# EAGLE design communicator_v2p3 (EAGLE 7.6.0)
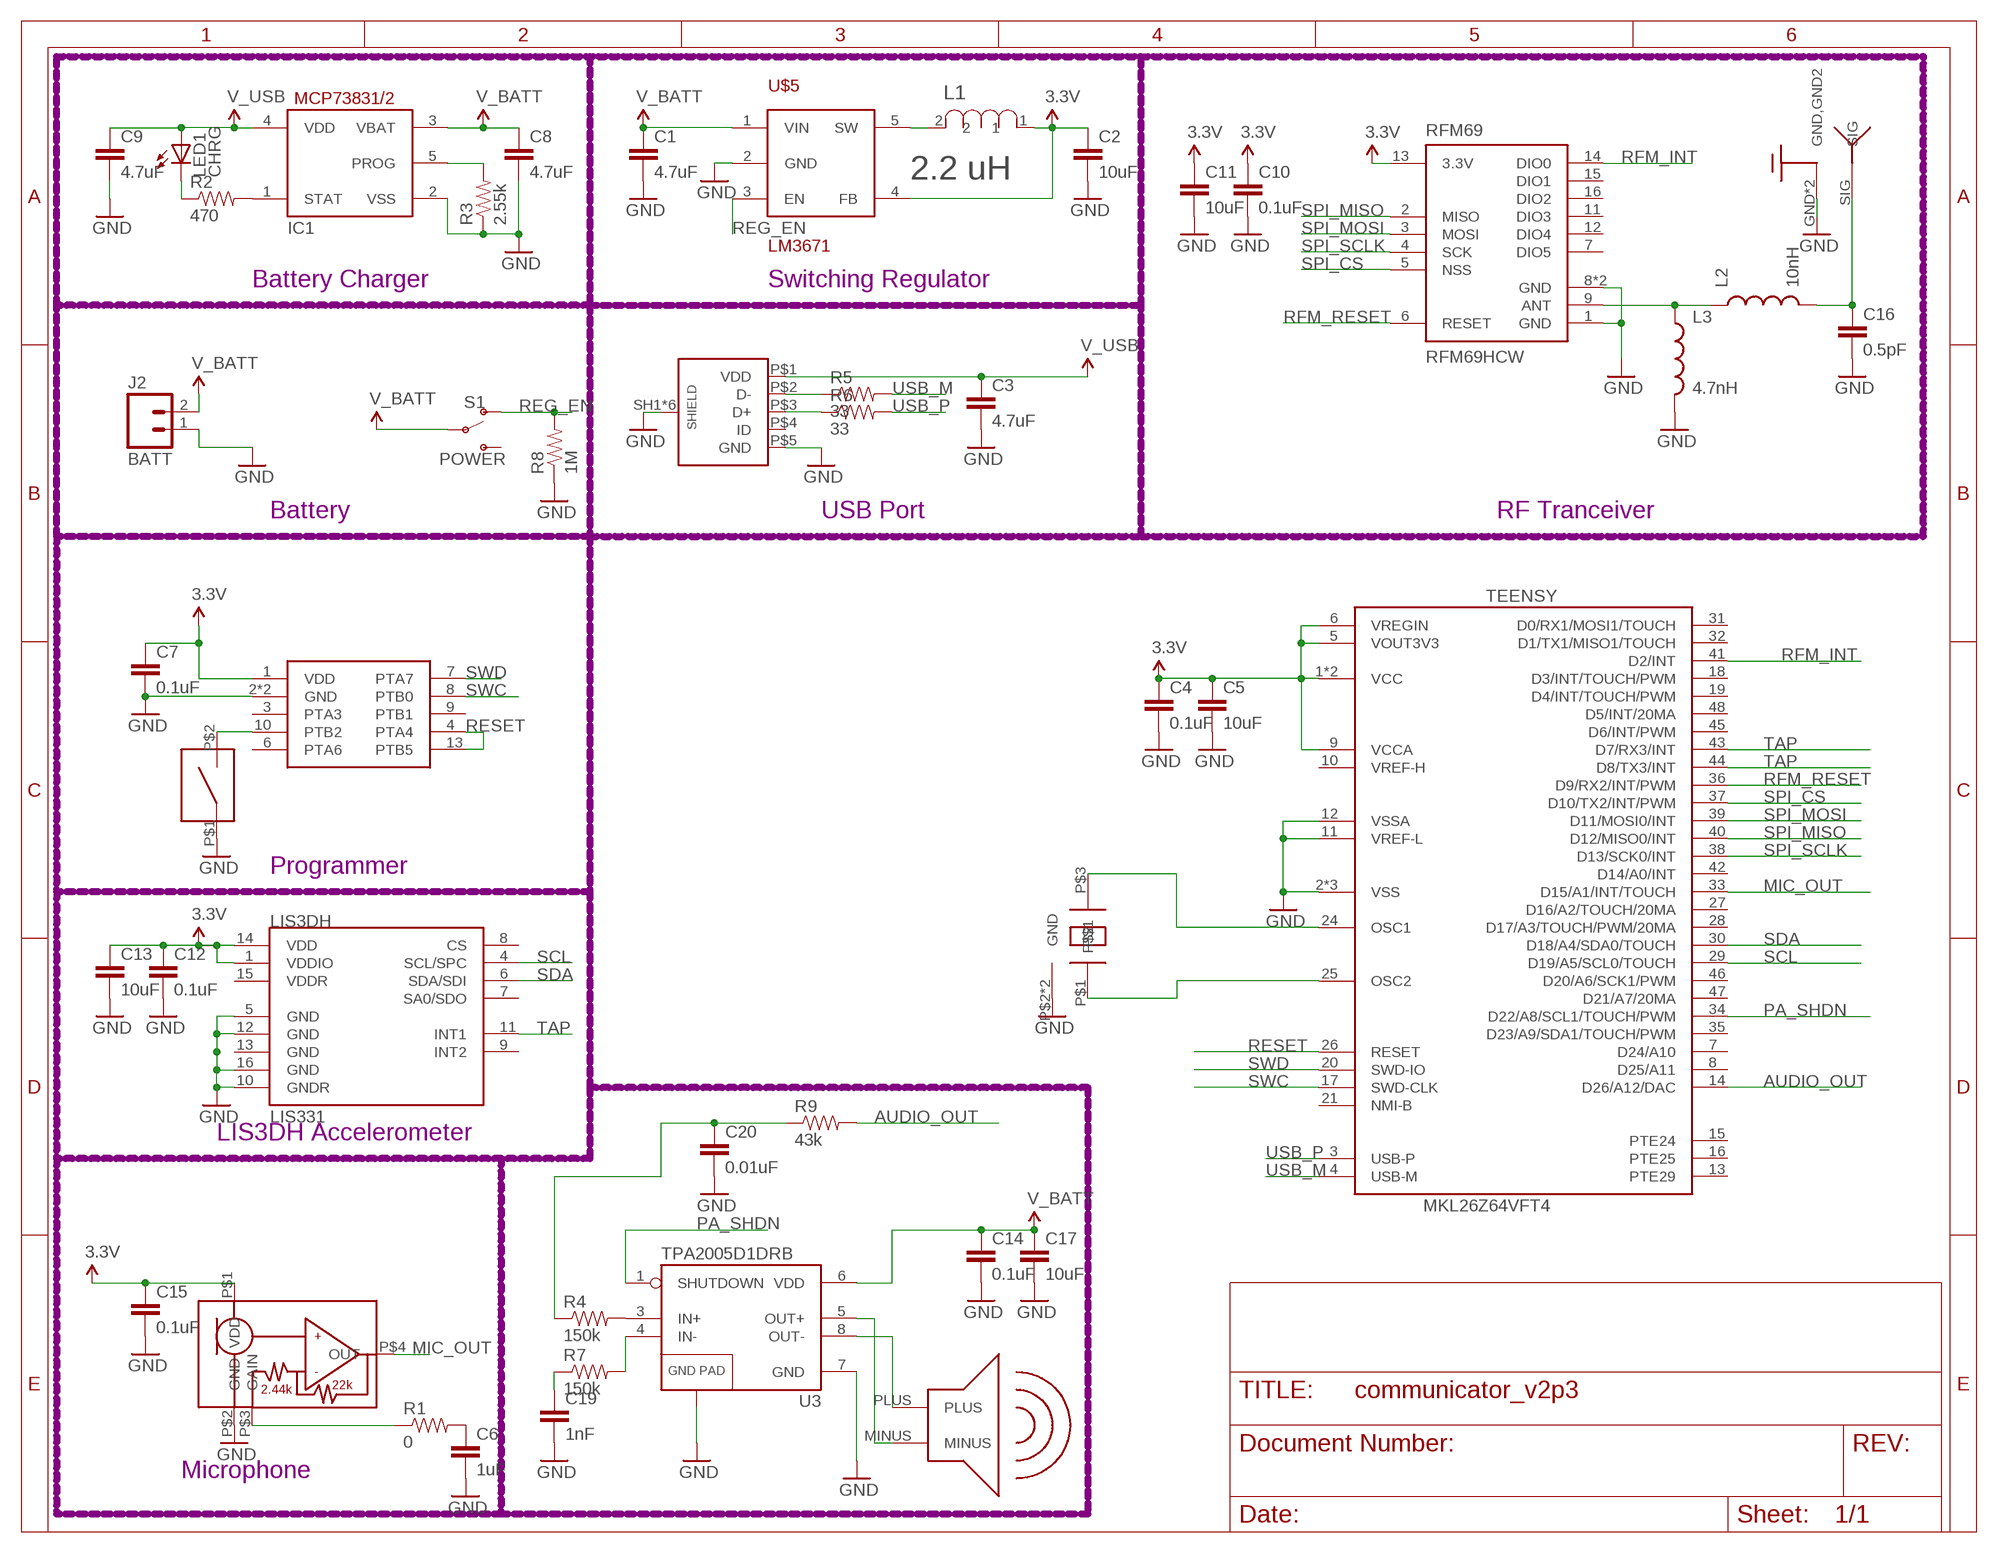
[diagram p0: schematic, sheet 1]

## Parts
3X3MM1  CURRENT_BOOTLOADER3X3MM  [QFN50P300X300X100-17N]
C1  4.7uF  0.1UF-25V(+80/-20%)(0603)  [0603-CAP]
C2  10uF  2.2UF-10V-20%(0603)  [0603-CAP]
C3  4.7uF  2.2UF-10V-20%(0603)  [0603-CAP]
C4  0.1uF  0.1UF-25V(+80/-20%)(0603)  [0603-CAP]
C5  10uF  10UF-6.3V-20%(0603)  [0603-CAP]
C6  1uF  0.1UF-25V(+80/-20%)(0603)  [0603-CAP]
C7  0.1uF  0.1UF-25V(+80/-20%)(0603)  [0603-CAP]
C8  4.7uF  4.7UF-6.3V-10%(0603)0603  [0603-CAP]
C9  4.7uF  4.7UF-6.3V-10%(0603)0603  [0603-CAP]
C10  0.1uF  0.1UF-25V(+80/-20%)(0603)  [0603-CAP]
C11  10uF  10UF-6.3V-20%(0603)  [0603-CAP]
C12  0.1uF  0.1UF-25V(+80/-20%)(0603)  [0603-CAP]
C13  10uF  10UF-6.3V-20%(0603)  [0603-CAP]
C14  0.1uF  0.1UF-25V(+80/-20%)(0603)  [0603-CAP]
C15  0.1uF  0.1UF-25V(+80/-20%)(0603)  [0603-CAP]
C16  0.5pF  0.75PF-50V(-/+.25PF)(0603)  [0603-CAP]
C17  10uF  10UF-6.3V-20%(0603)  [0603-CAP]
C19  1nF  0.1UF-25V(+80/-20%)(0603)  [0603-CAP]
C20  0.01uF  0.1UF-25V(+80/-20%)(0603)  [0603-CAP]
IC1  MCP73831/OT  [SOT23-5L]
J2  BATT  M02PTH  [1X02]
L1  2.2 uH  PM1210-2R2J-RC  [INDC3225X22N]
L2  10nH  INDUCTOR0603  [0603]
L3  4.7nH  INDUCTOR0603  [0603]
LED1  CHRG  LEDCHIPLED_0805  [CHIPLED_0805]
LIS3DH  LIS331  [LGA16-3MM]
R1  0  33OHM1/10W1%(0603)  [0603-RES]
R2  470  470OHM1/10W1%(0603)  [0603-RES]
R3  2.55k  2.55KOHM-1/10W-1%(0603)  [0603-RES]
R4  150k  33OHM1/10W1%(0603)  [0603-RES]
R5  33  33OHM1/10W1%(0603)  [0603-RES]
R6  33  33OHM1/10W1%(0603)  [0603-RES]
R7  150k  33OHM1/10W1%(0603)  [0603-RES]
R8  1M  2.55KOHM-1/10W-1%(0603)  [0603-RES]
R9  43k  33OHM1/10W1%(0603)  [0603-RES]
RFM69  RFM69HCW  [RFM69HCW-XXXS2]
S1  POWER  SWITCH-SPDT-SMD-RIGHT-ANGLE  [SWITCH_SPST_SMD_A]
TEENSY  MKL26Z64VFT4  [QFN50P700X700X100-49N]
U3  TPA2005D1DRB  [QFN-8_PAD]
U$1  ANTENNA_915MHZ  [ANTENNA_915MHZ]
U$2  MICROPHONE  [SPU0414HR5H-SB]
U$3  SPEAKER  [PSR1511N08S3K]
U$4  KXT131LHS  [KXT131LHS]
U$5  LM3671  [SOT23-5]
U$8  MICRO_USB_B  [MICRO_USB_B]
U$9  TSX-3225  [TSX-3225]

## Nets
3.3V: 3X3MM1.1(VDD) C2.1 C4.1 C5.1 C7.1 C10.1 C11.1 C12.1 C13.1 C15.1 L1.1 LIS3DH.1(VDDIO) LIS3DH.14(VDD) RFM69.13(3.3V) TEENSY.1(VCC) TEENSY.5(VOUT3V3) TEENSY.6(VREGIN) TEENSY.9(VCCA) TEENSY.22(VCC) U$2.P$1(VDD) U$5.4(FB)
AUDIO_OUT: R9.2 TEENSY.14(D26/A12/DAC)
GND: 3X3MM1.2(GND) 3X3MM1.17(GND) C1.2 C2.2 C3.2 C4.2 C5.2 C6.2 C7.2 C8.2 C9.2 C10.2 C11.2 C12.2 C13.2 C14.2 C15.2 C16.2 C17.2 C19.2 C20.2 IC1.2(VSS) J2.1 L3.2 LIS3DH.5(GND) LIS3DH.10(GNDR) LIS3DH.12(GND) LIS3DH.16(GND) R3.1 R8.1 RFM69.1(GND) RFM69.8(GND) RFM69.10(GND) TEENSY.2(VSS) TEENSY.11(VREF-L) TEENSY.12(VSSA) TEENSY.23(VSS) TEENSY.49(VSS) U3.7(GND) U3.9(GND) U3.10(GND) U3.11(GND) U3.12(GND) U3.13(GND) U$1.GND2(GND,GND2) U$1.GND(GND,GND2) U$2.P$2(GND) U$4.P$1 U$5.2(GND) U$8.P$5(GND) U$8.SH1(SHIELD) U$8.SH2(SHIELD) U$8.SH3(SHIELD) U$8.SH4(SHIELD) U$8.SH5(SHIELD) U$8.SH6(SHIELD) U$9.P$2(GND) U$9.P$4(GND)
MIC_OUT: TEENSY.33(D15/A1/INT/TOUCH) U$2.P$4(OUT)
N$1: R1.1 U$2.P$3(GAIN)
N$2: IC1.1(STAT) R2.2
N$3: C6.1 R1.2
N$4: C16.1 L2.2 U$1.SIG
N$5: TEENSY.24(OSC1) U$9.P$3
N$6: TEENSY.25(OSC2) U$9.P$1
N$7: U3.5(OUT+) U$3.MINUS
N$8: L2.1 L3.1 RFM69.9(ANT)
N$9: 3X3MM1.10(PTB2) U$4.P$2
N$10: U3.8(OUT-) U$3.PLUS
N$11: R4.2 U3.3(IN+)
N$12: R7.2 U3.4(IN-)
N$14: R5.1 U$8.P$2(D-)
N$15: R6.1 U$8.P$3(D+)
N$16: C19.1 R7.1
N$21: IC1.5(PROG) R3.2
N$25: LED1.C R2.1
N$31: L1.2 U$5.5(SW)
PA_IN: C20.1 R4.1 R9.1
PA_SHDN: TEENSY.34(D22/A8/SCL1/TOUCH/PWM) U3.1(SHUTDOWN)
REG_EN: R8.2 S1.1(O) U$5.3(EN)
RESET: 3X3MM1.4(PTA4) 3X3MM1.13(PTB5) TEENSY.26(RESET)
RFM_INT: RFM69.14(DIO0) TEENSY.41(D2/INT)
RFM_RESET: RFM69.6(RESET) TEENSY.36(D9/RX2/INT/PWM)
SCL: LIS3DH.4(SCL/SPC) TEENSY.29(D19/A5/SCL0/TOUCH)
SDA: LIS3DH.6(SDA/SDI) TEENSY.30(D18/A4/SDA0/TOUCH)
SPI_CS: RFM69.5(NSS) TEENSY.37(D10/TX2/INT/PWM)
SPI_MISO: RFM69.2(MISO) TEENSY.40(D12/MISO0/INT)
SPI_MOSI: RFM69.3(MOSI) TEENSY.39(D11/MOSI0/INT)
SPI_SCLK: RFM69.4(SCK) TEENSY.38(D13/SCK0/INT)
SWC: 3X3MM1.8(PTB0) TEENSY.17(SWD-CLK)
SWD: 3X3MM1.7(PTA7) TEENSY.20(SWD-IO)
TAP: LIS3DH.11(INT1) TEENSY.43(D7/RX3/INT) TEENSY.44(D8/TX3/INT)
USB_M: R5.2 TEENSY.4(USB-M)
USB_P: R6.2 TEENSY.3(USB-P)
V_BATT: C1.1 C8.1 C14.1 C17.1 IC1.3(VBAT) J2.2 S1.2(P) U3.6(VDD) U$5.1(VIN)
V_USB: C3.1 C9.1 IC1.4(VDD) LED1.A U$8.P$1(VDD)
Unconnected: 3X3MM1.3(PTA3) 3X3MM1.6(PTA6) 3X3MM1.9(PTB1) LIS3DH.7(SA0/SDO) LIS3DH.8(CS) LIS3DH.9(INT2) LIS3DH.13(GND) LIS3DH.15(VDDR) RFM69.7(DIO5) RFM69.11(DIO3) RFM69.12(DIO4) RFM69.15(DIO1) RFM69.16(DIO2) S1.3(S) TEENSY.7(D24/A10) TEENSY.8(D25/A11) TEENSY.10(VREF-H) TEENSY.13(PTE29) TEENSY.15(PTE24) TEENSY.16(PTE25) TEENSY.18(D3/INT/TOUCH/PWM) TEENSY.19(D4/INT/TOUCH/PWM) TEENSY.21(NMI-B) TEENSY.27(D16/A2/TOUCH/20MA) TEENSY.28(D17/A3/TOUCH/PWM/20MA) TEENSY.31(D0/RX1/MOSI1/TOUCH) TEENSY.32(D1/TX1/MISO1/TOUCH) TEENSY.35(D23/A9/SDA1/TOUCH/PWM) TEENSY.42(D14/A0/INT) TEENSY.45(D6/INT/PWM) TEENSY.46(D20/A6/SCK1/PWM) TEENSY.47(D21/A7/20MA) TEENSY.48(D5/INT/20MA) U$8.P$4(ID)

## Notes on the sheet
- Battery Charger | Switching Regulator
- Battery | USB Port | RF Tranceiver
- Programmer
- LIS3DH Accelerometer
- Microphone

## Library data of the parts
3X3MM1 = Teensy_DIY_v1.0:CURRENT_BOOTLOADER: MKL02Z32 and MKL04Z32 bootloader chips for Teensy LC (MKL26) and Teensy 3.2 (MKL20D256) processors. Remember, all power supply pins need to be decoupled! Also note the connections that Paul recommends on his bootloader page.
C1 C6 C19 C20 = SparkFun-Capacitors:0.1UF-25V(+80/-20%)(0603): CAP-00810 Ceramic Standard decoupling cap; PROD_ID: CAP-00810; VALUE: 0.1uF
C2 C3 = SparkFun-Capacitors:2.2UF-10V-20%(0603): CAP-07888; PROD_ID: CAP-07888; VALUE: 2.2uF
C4 C7 C10 C12 C14 C15 = SparkFun-Capacitors:0.1UF-25V(+80/-20%)(0603): CAP-00810 Ceramic Standard decoupling cap; PROD_ID: CAP-00810
C5 C11 C13 C17 = SparkFun-Capacitors:10UF-6.3V-20%(0603): CAP-11015; PROD_ID: CAP-11015
C8 C9 = SparkFun-Capacitors:4.7UF-6.3V-10%(0603): CAP-08280; PROD_ID: CAP-08280
C16 = SparkFun-Capacitors:0.75PF-50V(-/+.25PF)(0603): CAP-07878; PROD_ID: CAP-07878; VALUE: 0.75pF
IC1 = adafruit:MCP73831: MCP73831/2 Miniature Single-Cell, Fully Integrated Li-Ion, Li-Polymer Charge Management Controllers. Nice and small simple lipoly charge controller, with adjustable current and status output (LED) http://www.ladyada.net/library/pcb/eaglelibrary.html
J2 = SparkFun-Connectors:M02: Standard 2-pin 0.1" header. Use with - straight break away headers ( PRT-00116) - right angle break away headers (PRT-00553) - swiss pins (PRT-00743) - machine pins (PRT-00117) - female headers (PRT-00115) Molex polarized connector foot print use with: PRT-08233 with associated crimp pins and housings. 2.54_SCREWTERM for use with PRT-10571. 3.5mm Screw Terminal footprints for PRT-08084 5mm Screw Terminal footprints for use with PRT-08432
L1 = Bourns_By_element14_Batch_1:PM1210-2R2J-RC: CHIP INDUCTOR, 2.2UH 320MA 5% 75MHZ; MPN: PM1210-2R2J-RC; OC_FARNELL: 1180471; OC_NEWARK: 63K3102; SUPPLIER: BOURNS; TOLERANCE: ±5 %
L2 L3 = SparkFun-Passives:INDUCTOR: Inductors Basic Inductor/Choke - 0603 and 1206. Footprints are not proven and vary greatly between part numbers. INDUCTOR POWER 3.3UH 4.0A SMD 0.197" L x 0.197" W x 0.177" H (5.00mm x 5.00mm x 4.50mm)
LED1 = adafruit:LED: LED OSRAM: - CHIPLED LG R971, LG N971, LY N971, LG Q971, LY Q971, LO R971, LY R971 LH N974, LH R974 LS Q976, LO Q976, LY Q976 LO Q996 - Hyper CHIPLED LW Q18S LB Q993, LB Q99A, LB R99A - SideLED LS A670, LO A670, LY A670, LG A670, LP A670 LB A673, LV A673, LT A673, LW A673 LH A674 LY A675 LS A676, LA A676, LO A676, LY A676, LW A676 LS A679, LY A679, LG A679 - Hyper Micro SIDELED® LS Y876, LA Y876, LO Y876, LY Y876 LT Y87S - SmartLED LW L88C, LW L88S LB L89C, LB L89S, LG L890 LS L89K, LO L89K, LY L89K LS L896, LA L896, LO L896, LY L896 - TOPLED LS T670, LO T670, LY T670, LG T670, LP T670 LSG T670, LSP T670, LSY T670, LOP T670, LYG T670 LG T671, LOG T671, LSG T671 LB T673, LV T673, LT T673, LW T673 LH T674 LS T676, LA T676, LO T676, LY T676, LB T676, LH T676, LSB T676, LW T676 LB T67C, LV T67C, LT T67C, LS T67K, LO T67K, LY T67K, LW E67C LS E67B, LA E67B, LO E67B, LY E67B, LB E67C, LV E67C, LT E67C LW T67C LS T679, LY T679, LG T679 LS T770, LO T770, LY T770, LG T770, LP T770 LB T773, LV T773, LT T773, LW T773 LH T774 LS E675, LA E675, LY E675, LS T675 LS T776, LA T776, LO T776, LY T776, LB T776 LHGB T686 LT T68C, LB T68C - Hyper Mini TOPLED® LB M676 - Mini TOPLED Santana® LG M470 LS M47K, LO M47K, LY M47K Source: http://www.osram.convergy.de/
LIS3DH = SparkFun-Sensors:LIS331: 3-axis 6/12/24g SPI/I2C accelerometer
R1 R4 R7 R9 = SparkFun-Resistors:33OHM1/10W1%(0603): RES-08270; PROD_ID: RES-08270; VALUE: 33
R2 = SparkFun-Resistors:470OHM1/10W1%(0603): RES-07869; PROD_ID: RES-07869
R3 = SparkFun-Resistors:2.55KOHM-1/10W-1%(0603): RES-11227; PROD_ID: RES-11227
R5 R6 = SparkFun-Resistors:33OHM1/10W1%(0603): RES-08270; PROD_ID: RES-08270
R8 = SparkFun-Resistors:2.55KOHM-1/10W-1%(0603): RES-11227; PROD_ID: RES-11227; VALUE: 2.55k
RFM69 = SparkFun-RF:RFM69H; PROD_ID: IC-11997, IC-12053
S1 = SparkFun-Switches:SWITCH-SPDT: Single Pole, Double Throw (SPDT) Switch Single-pole, double-throw (SPDT) switch. Variant Overview SMD-AYZ0202 Surface Mount DPDT Switch <https://www.sparkfun.com/products/597> (COM-00597) Used on e.g. LilyPad Arduino USB - ATmega32U4 Board <https://www.sparkfun.com/products/12049> PTH-11.6X4.0MM SPDT Mini Power Switch <https://www.sparkfun.com/products/102> (COM-00102) Used on e.g. SparkFun Simon Says - Through-Hole Soldering Kit <https://www.sparkfun.com/products/10547> (KIT-10547) PTH-11.6X4.0MM-KIT KIT version of SPDT Mini Power Switch - Simplifies soldering by removing tStop of switch pins - only one side can be soldered. PTH-11.6X4.0MM-LOCK LOCK version of SPDT Mini Power Switch - Offset pins hold switch in place for easier soldering. SMD-RIGHT-ANGLE Surface Mount Right Angle Switch <https://www.sparkfun.com/products/10860> (COM-10860) Used on e.g. SparkFun ESP8266 Thing <https://www.sparkfun.com/products/13231>; PROD_ID: SWCH-10651; SF_SKU: COM-10860
TEENSY = Teensy_DIY_v1.0:MKL26Z64VFT4: This is a Teensy LC MCU based on the MKL26Z64VFT4. Note: To enable USB, you need to have 3.3V at VOUT3V3. If you want to supply 3.3V power externally, provide it to VCC, VREGIN, and VOUT3V3. The Voltage Regulator will go into dropout mode.
U3 = SparkFun-AnalogIC:TPA2005D1: 1.4W MONO CLASS-D AUDIO POWER AMPLIFIER The TPA2005D1 is a 1.4-W high efficiency filter-free class-D audio power amplifier in a BGA, QFN, or MSOP package that requires only three external components. Datasheet: http://focus.ti.com/lit/ds/symlink/tpa2005d1.pdf 1.4 W Into 8 ? From a 5V Supply at THD = 10% (Typ) Maximum Battery Life and Minimum Heat Efficiency With an 8-? Speaker: 84% at 400 mW, 79% at 100 mW 2.8-mA Quiescent Current 0.5-mA Shutdown Current Ideal for Wireless or Cellular Handsets and PDAs Capable of Driving an 8-? Speaker (2.5 V ? VDD ? 5.5 V) and a 4-? Speaker (2.5 V ? VDD ? 4.2 V) Only Three External Components Optimized PWM Output Stage Eliminates LC Output Filter Internally Generated 250-kHz Switching Frequency Eliminates Capacitor and Resistor Improved PSRR (-71 dB at 217 Hz) and Wide Supply Voltage (2.5 V to 5.5 V) Eliminates Need for a Voltage Regulator Fully Differential Design Reduces RF Rectification and Eliminates Bypass Capacitor Improved CMRR Eliminates Two Input Coupling Capacitors
U$1 = prototype:ANTENNA_915MHZ
U$2 = prototype:MICROPHONE
U$3 = prototype:SPEAKER
U$4 = prototype:KXT131LHS
U$5 = texas-custom:LM3671: Texas Instruments LM3671, LM3671Q 2MHz, 600mA Step-Down DC-DC Converter
U$8 = prototype:MICRO_USB_B
U$9 = prototype:TSX-3225

## Board
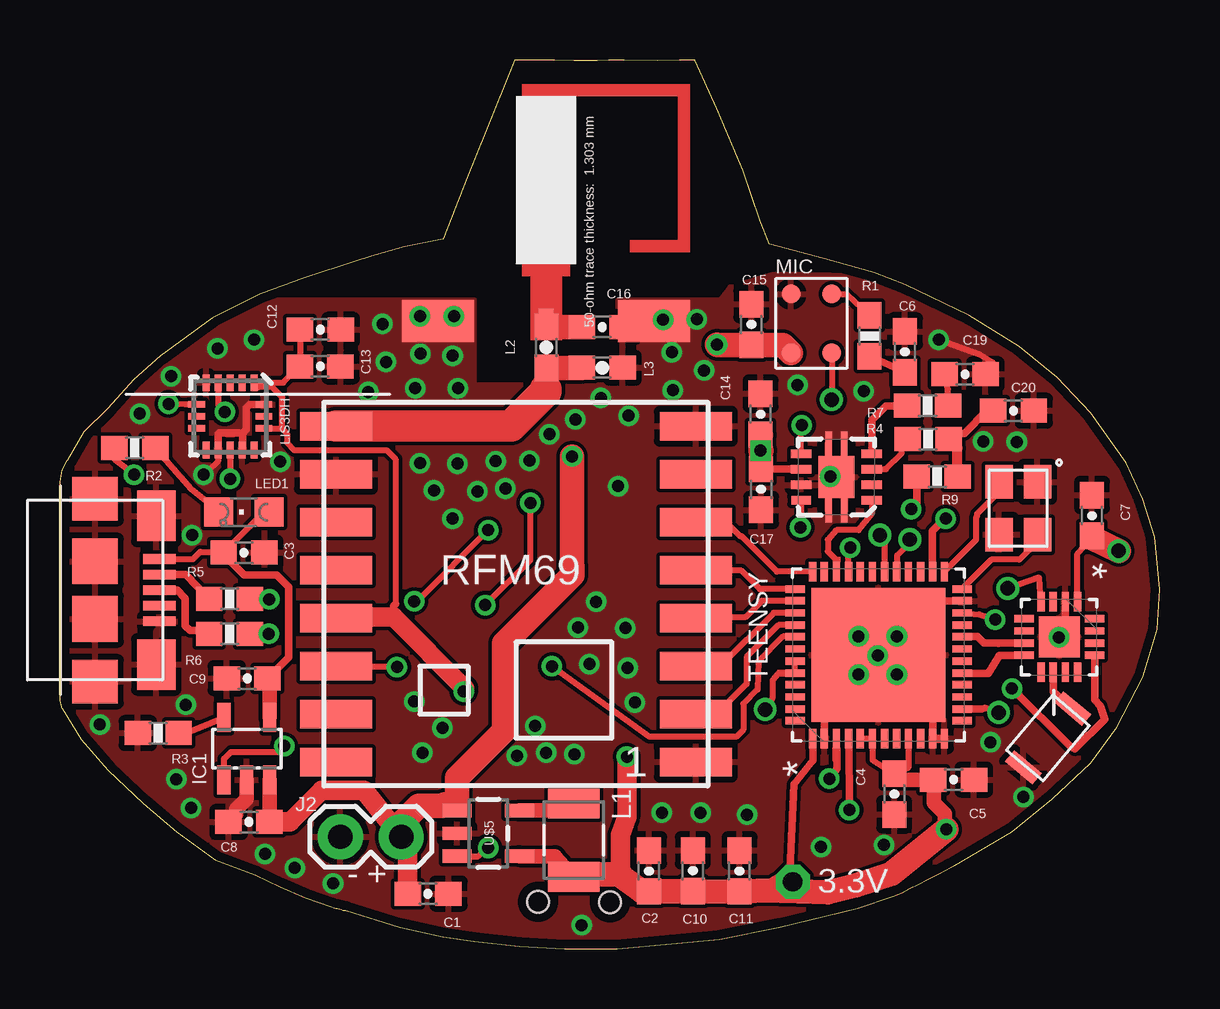
[diagram p1: board, top side]
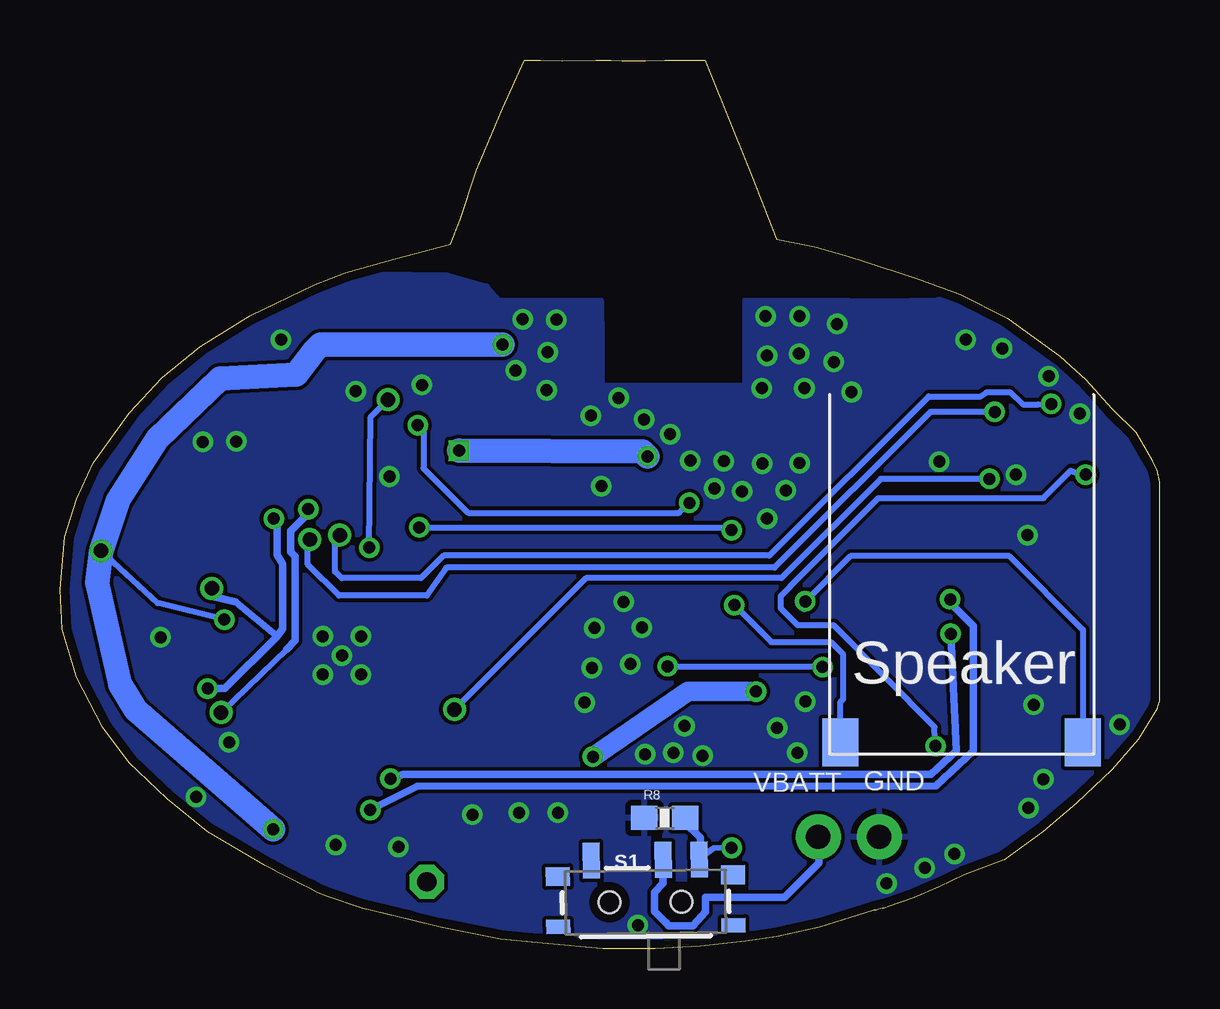
[diagram p2: board, bottom side, seen from below]

Size 45.84 x 37.04 mm. Coordinates in mm from the lower left corner, seen from the top.
Outline: 0.1,10.02 0.89,8.73 1.98,7.44 3.47,6.05 4.86,4.86 6.47,3.71 8.14,3.08 arc10 11.33,1.74 11.33,1.74 11.43,1.71 11.49,1.69 11.56,1.67 11.71,1.63 11.81,1.61 11.91,1.59 14.19,0.89 15.97,0.5 17.26,0.3 19.15,0.1 21.03,0 23.22,0 25.5,0.2 27.48,0.4 29.96,0.89 31.25,1.19 33.24,1.69 34.72,2.18 35.09,2.32 35.42,2.51 35.78,2.69 36.17,2.89 36.67,3.15 37.13,3.38 37.3,3.47 39.69,4.86 41.37,6.25 42.96,7.74 44.05,9.23 45.14,11.31 45.74,13.29 45.84,14.98 45.64,17.16 45.14,18.75 44.45,20.24 42.96,22.32 41.57,23.81 39.98,25.1 37.9,26.39 35.22,27.68 33.93,28.18 31.85,28.77 29.57,29.37 29.17,30.36 28.47,32.44 27.38,35.02 26.47,37.02 25.82,37.03 24.9,37.02 23.51,37.03 22.87,37.02 22.42,37.02 22.02,37.02 21.42,37.02 20.61,37.03 19.78,37.04 18.95,37.03 16.97,32.15 15.97,29.57 14.39,29.27 13,28.87 10.22,27.98 8.33,27.28 6.35,26.29 4.17,24.7 3.08,23.71 1.98,22.52 0.99,21.53 0.3,20.34 0.1,19.94 0,19.45 0,10.32 0.1,10.02
Copper layers (1*16): Top 0.0356mm / dielectric 1.5011mm / Bottom 0.0356mm
Design rules "oshpark-2layer *": minimum track width 6mil, minimum drill 13mil, track to track 6mil, track to pad 6mil, pad to pad 6mil, via to via 6mil, smd to smd 6mil, copper to edge 15mil, drill to drill 6mil, minimum pad ring 7mil, minimum via ring 7mil, stop-mask expansion 2.5mil, vias tented up to drill 0.51mm, thermal gap 10mil

### Footprints (pad centres in the part's own frame; a part is rotated, then mirrored left to right if it is on the bottom)
QFN50P300X300X100-17N = smd 0.813 x 0.305: 1 -1.473,0.762; 2 -1.473,0.254; 3 -1.473,-0.254; 4 -1.473,-0.762; 9 1.473,-0.762; 10 1.473,-0.254; 11 1.473,0.254; 12 1.473,0.762 | smd 0.305 x 0.813: 5 -0.762,-1.473; 6 -0.254,-1.473; 7 0.254,-1.473; 8 0.762,-1.473; 13 0.762,1.473; 14 0.254,1.473; 15 -0.254,1.473; 16 -0.762,1.473 | smd 1.702 x 1.702: 17 0,0
0603-CAP = smd 1.1 x 1: 1 -0.85,0; 2 0.85,0
SOT23-5L = smd 0.55 x 1.2: 1 -0.95,-1.3; 2 0,-1.3; 3 0.95,-1.3; 4 0.95,1.3; 5 -0.95,1.3
1X02 = drill 1.016 pad 1.88: 1 0,0; 2 2.54,0
INDC3225X22N = smd 1.245 x 2.159: 1 -1.524,0; 2 1.524,0
0603 = smd 1.1 x 1: 1 -0.85,0; 2 0.85,0
CHIPLED_0805 = smd 1.2 x 1.2: A 0,-1.05; C 0,1.05
LGA16-3MM = smd 0.7 x 0.28: 1 -1.4,1; 2 -1.4,0.5; 3 -1.4,0; 4 -1.4,-0.5; 5 -1.4,-1; 9 1.4,-1; 10 1.4,-0.5; 11 1.4,0; 12 1.4,0.5; 13 1.4,1 | smd 0.28 x 0.7: 6 -0.5,-1.4; 7 0,-1.4; 8 0.5,-1.4; 14 0.5,1.4; 15 0,1.4; 16 -0.5,1.4
0603-RES = smd 1.1 x 1: 1 -0.85,0; 2 0.85,0
RFM69HCW-XXXS2 = smd 3 x 1.2: 1 -7.5,7; 2 -7.5,5; 3 -7.5,3; 4 -7.5,1; 5 -7.5,-1; 6 -7.5,-3; 7 -7.5,-5; 8 -7.5,-7; 9 7.5,-7; 10 7.5,-5; 11 7.5,-3; 12 7.5,-1; 13 7.5,1; 14 7.5,3; 15 7.5,5; 16 7.5,7
SWITCH_SPST_SMD_A = smd 0.7 x 1.5: 1 -2.25,-1.75; 2 -0.75,-1.75; 3 2.25,-1.75 | smd 1 x 0.6: GND1 -3.65,1; GND3 3.65,1 | smd 1 x 0.8: GND2 -3.65,-1.1; GND4 3.65,-1.1 | hole 0.9: -1.5,0; 1.5,0
QFN50P700X700X100-49N = smd 0.813 x 0.305: 1 -3.48,2.743; 2 -3.48,2.261; 3 -3.48,1.753; 4 -3.48,1.245; 5 -3.48,0.762; 6 -3.48,0.254; 7 -3.48,-0.254; 8 -3.48,-0.762; 9 -3.48,-1.245; 10 -3.48,-1.753; 11 -3.48,-2.261; 12 -3.48,-2.743; 25 3.48,-2.743; 26 3.48,-2.261; 27 3.48,-1.753; 28 3.48,-1.245; 29 3.48,-0.762; 30 3.48,-0.254; 31 3.48,0.254; 32 3.48,0.762; 33 3.48,1.245; 34 3.48,1.753; 35 3.48,2.261; 36 3.48,2.743 | smd 0.305 x 0.813: 13 -2.743,-3.48; 14 -2.261,-3.48; 15 -1.753,-3.48; 16 -1.245,-3.48; 17 -0.762,-3.48; 18 -0.254,-3.48; 19 0.254,-3.48; 20 0.762,-3.48; 21 1.245,-3.48; 22 1.753,-3.48; 23 2.261,-3.48; 24 2.743,-3.48; 37 2.743,3.48; 38 2.261,3.48; 39 1.753,3.48; 40 1.245,3.48; 41 0.762,3.48; 42 0.254,3.48; 43 -0.254,3.48; 44 -0.762,3.48; 45 -1.245,3.48; 46 -1.753,3.48; 47 -2.261,3.48; 48 -2.743,3.48 | smd 5.588 x 5.588: 49 0,0
QFN-8_PAD = smd 0.35 x 0.85: 1 -0.975,-1.475; 2 -0.325,-1.475; 3 0.325,-1.475; 4 0.975,-1.475; 5 0.975,1.475; 6 0.325,1.475; 7 -0.325,1.475; 8 -0.975,1.475 | smd 1.75 x 1.5: 9 0,0 | smd 1.025 x 0.28: 10 -1.387,-0.325; 11 1.387,-0.325; 12 1.387,0.325; 13 -1.387,0.325
ANTENNA_915MHZ = smd 1.75 x 3: GND -3.12,4.5; GND2 -3.12,-4.5 | smd 1.27 x 0.635: SIG -3.25,0
SPU0414HR5H-SB = smd 0.8 x 0.8: P$1 0.85,1.23; P$2 0.85,-1.23; P$3 -0.85,-1.23; P$4 -0.85,1.23
PSR1511N08S3K = smd 1.5 x 2: MINUS 5.05,7; PLUS -5.05,7
KXT131LHS = smd 0.6 x 1.5: P$1 -1.6,0; P$2 1.6,0
SOT23-5 = smd 0.55 x 1.2: 1 -0.95,-1.3; 2 0,-1.3; 3 0.95,-1.3; 4 0.95,1.3; 5 -0.95,1.3
MICRO_USB_B = smd 0.4 x 1.35: P$1 -1.3,2.675; P$2 -0.65,2.675; P$3 0,2.675; P$4 0.65,2.675; P$5 1.3,2.675 | smd 2.1 x 1.6: SH1 -3.1,2.55; SH2 3.1,2.55 | smd 1.8 x 1.9: SH3 -3.81,0; SH6 3.81,0 | smd 1.9 x 1.9: SH4 -1.2,0; SH5 1.2,0
TSX-3225 = smd 1.4 x 1.15: P$1 -1.1,-0.8; P$2 1.1,-0.8; P$3 1.1,0.8; P$4 -1.1,0.8

### Placement (x,y rotation side)
3X3MM1  41.65,12.99 270 top
C1  15.34,2.29 0 top
C2  24.55,3.24 90 top
C3  7.67,16.5 0 top
C4  34.77,6.44 270 top
C5  37.25,7.04 0 top
C6  35.23,24.88 90 top
C7  43.02,18.05 90 top
C8  7.88,5.28 180 top
C9  7.8,11.26 180 top
C10  26.38,3.24 90 top
C11  28.33,3.24 90 top
C12  10.85,25.8 0 top
C13  10.85,24.27 0 top
C14  29.21,22.28 90 top
C15  28.82,26.01 90 top
C16  22.6,25.91 0 top
C17  29.23,19.14 270 top
C19  37.73,23.94 0 top
C20  39.75,22.42 0 top
IC1  7.79,8.34 0 top
J2  11.69,4.66 0 top
L1  21.41,4.52 90 top
L2  20.27,25.06 90 top
L3  22.6,24.21 0 top
LED1  7.66,18.2 90 top
LIS3DH  7.1,22.19 270 top
R1  33.75,25.54 270 top
R2  3.12,20.88 180 top
R3  4.1,8.98 0 top
R4  36.19,21.24 180 top
R5  7.07,14.58 0 top
R6  7.07,13.11 0 top
R7  36.17,22.64 180 top
R8  20.63,5.44 0 bottom
R9  36.57,19.68 180 top
RFM69  19,14.78 180 top
S1  21.43,1.94 180.6 bottom
TEENSY  34.12,12.24 90 top
U3  32.37,19.66 90 top
U$1  20.27,29.28 90 top
U$2  31.33,26.06 180 top
U$3  8.25,15.6 180 bottom
U$4  41.19,8.78 50 top
U$5  17.85,4.8 270 top
U$8  1.47,14.94 270 top
U$9  39.95,18.36 270 top

### Tracks (layer width: path | path; a pad name or v marks a point on that pad's centre or on a via)
3.3V  (via drill 0.5, 0.6, 0.8 pad 1.42)
  Top 0.254: 24.36,2.66 C2.1 | TEENSY.5 TEENSY.6 33.87,7.86 C4.1 35.36,7.54 TEENSY.9 | LIS3DH.14 9.24,21.69 9.26,21.67 | 9.26,21.67 9.26,22.98 8.83,23.41 8.28,23.41 LIS3DH.1 9.31,23.59 C13.1 C12.1 | 43.02,17.13 42.41,16.46 3X3MM1.1 | TEENSY.22 38.32,13.93 v38.99,13.72 | 9.26,21.67 9.47,21.47 9.47,21.1 9.77,20.78 13.61,20.78 13.99,20.4 13.99,14.36 | 16.87,10.77 v16.83,10.72 | v23.63,8 23.91,6.74
  Top 0.305: TEENSY.1 31.38,7.85 30.59,6.84 30.41,2.83 | 36.89,4.88 36.89,4.92 v36.95,4.98 | v30.55,2.78 29.81,2.14 30.08,2.41 | 13.91,13.82 13.91,14.28 13.99,14.36
  Top 0.61: U$5.4 20.64,3.86 L1.1 | 36.89,4.88 36.89,5.62 36.43,6.08 36.43,7.02 C5.1 34.87,7.04 C4.1
  Top 0.813: v23.63,8 23.63,5.5 23.37,4.74 23.37,3.1 | 16.87,10.77 16.87,10.85 13.91,13.82 11.55,13.82 RFM69.13
  Top 1.016: 29.73,2.42 C11.1 26.42,2.37 C10.1 25.4,2.39 C2.1 24.27,2.38 23.37,3.04 23.37,3.1 22.42,3.1 L1.1 | C7.1 43.02,17.13 v44.13,16.58 | 29.73,2.42 30.08,2.41 32.01,2.34 33.19,2.64 34.67,3.12 v36.95,4.98 | 29.73,2.42 30.41,2.83 | v27.39,25.18 27.4,25.16 C15.1 30.14,25.16 U$2.P$1
  Bottom 0.254: v38.99,13.72 41.77,14.4 v44.13,16.58
  Bottom 0.813: v16.83,10.72 19.67,10.72 v23.63,8
  Bottom 1.016: v36.95,4.98 42.69,9.94 43.33,11.02 44.29,15.24 v44.13,16.58 43.41,18.7 41.79,21.24 39.17,23.76 35.99,23.92 35.25,24.9 34.97,25.18 v27.39,25.18
AUDIO_OUT  (via drill 0.5, 0.6)
  Top 0.254: v39.13,9.84 38.55,10.04 38.49,9.98 TEENSY.14 | TEENSY.14
  Top 0.305: 35.45,18.52 35.59,18.3 v35.49,18.32 35.72,18.55 R9.2
  Bottom 0.254: 36.39,12.48 v39.13,9.84
  Bottom 0.305: v35.49,18.32 35.49,18.14 36.23,17.4 36.23,16.54 36.03,16.34 36.03,12.84 36.39,12.48
GND  (via drill 0.5)
  Top 0.254: LIS3DH.10 6.6,20.33 6.19,19.92 6.03,19.92 5.95,19.84 | v36.63,25.38 38.33,24.78 38.87,24.44 C19.2
  Top 0.305: TEENSY.2 31.86,9.98 TEENSY.49 | TEENSY.11 36.82,8.76 36.87,8.72 36.39,8.72 36.39,9.98 TEENSY.49 | TEENSY.23 36.38,14.5 TEENSY.49 | LIS3DH.16 7.91,22.69 7.77,22.54 7.77,21.64 7.61,21.48 | 7.61,21.48 LIS3DH.12 | LIS3DH.10 6.6,21.45 6.65,21.5 7.59,21.5 7.61,21.48 | U3.12 32.04,19.99 U3.9 | U3.13 32.04,19.34 U3.9 | U3.10 32.69,19.34 U3.9 | 3X3MM1.2 41.91,13.24 3X3MM1.17
  Top 0.406: U$5.2 16.75,4.81 16.75,4.76
  Top 0.61: IC1.2 7.79,6.24 7.35,5.8 7.35,5.6 C8.2
  other vias: 38.79,8.6 23.67,11.7 23.27,19.28 23.57,13.36 25.15,26.22 8.09,25.38 16.59,23.36 16.57,20.22 15.95,9.2 20.27,8.16 25.09,5.66 34.35,4.32 5.99,19.76 5.51,17.24 26.55,26.24 25.51,24.86 26.85,24.1 25.55,23.28 16.37,24.72 16.43,26.36 15.01,26.36 15.03,24.8 13.45,26.04 17.41,19.06 18.17,20.32 22.55,22.96 19.57,20.34 33.51,23.24 30.75,23.5 34.09,12.22 39.89,21.12 38.49,21.14 15.11,8.16 19.05,8.04 40.17,6.32 9.79,3.36 5.47,5.86 5.25,10.16 21.59,13.38 15.59,19.1 14.77,10.3 21.45,8.1 23.97,10.26 4.85,7.06 6.57,25.02 13.59,24.46 15.01,20.24 21.49,22.06 23.71,22.22 22.07,11.86 19.81,9.28 14.81,23.36 12.85,23.2 16.37,17.92 22.35,14.46 20.41,21.44 18.57,19.18 28.65,5.58 26.71,5.66 41.65,12.98 32.11,19.68 31.73,4.24 9.19,20.3 21.75,0.98 1.67,9.34 4.63,23.86 3.33,22.3 33.29,13.02 33.29,11.42 34.89,11.42 34.89,13.02 11.39,2.72 8.55,3.94
  pour Top: 0.19,9.78 1.79,7.38 4.91,4.78 9.49,2.34 14.09,0.86 18.67,-0.04 23.63,-0.04 27.89,0.36 33.85,1.72 39.45,4.6 43.37,7.92 45.49,11.8 45.99,13.92 45.67,17.16 44.47,20.58 42.57,22.92 39.25,25.64 34.51,28.02 29.77,28.1 27.95,27.56 27.53,27.02 23.27,27.02 23.27,23.48 17.27,23.48 17.27,27.02 13.01,27.02 9.19,27.04 8.23,27.28 6.37,26.26 3.19,23.9 1.75,22.44 0.09,19.9 -0.05,19.36 -0.03,10.44 0.05,9.98
  pour Bottom: 9.23,27.04 8.33,27.32 6.19,26.22 3.37,24.08 0.95,21.48 0.07,19.94 -0.01,19.36 -0.01,10.3 0.09,9.94 0.95,8.62 2.47,6.94 4.81,4.84 9.45,2.38 13.91,1 17.07,0.32 22.21,-0.04 27.55,0.4 33.31,1.7 35.97,2.7 40.59,5.52 42.93,7.7 44.11,9.28 45.15,11.4 45.81,13.32 45.85,14.98 45.67,17.18 44.71,19.7 43.05,22.26 41.27,24.04 37.79,26.48 34.01,28.14 29.75,28.08 28.05,27.6 27.53,27.02 23.29,27.02 23.27,25.28 23.27,23.48 17.27,23.48 17.27,27.02 13.01,27.02 11.67,27
MIC_OUT  (via drill 0.5, 0.6)
  Top 0.254: TEENSY.33 32.88,16.71 v32.95,16.72 | U$2.P$4 v32.18,22.89 v32.17,22.88
  Bottom 0.254: v32.95,16.72 32.89,22.16 v32.17,22.88
N$1
  Top 0.254: U$2.P$3 32.79,27.29 R1.1
N$2  (via drill 0.5)
  Top 0.254: IC1.1 6.84,7.91 7.13,8.2 9.11,8.2 v9.35,8.44 | v3.09,19.76 2.63,20.12 2.31,20.36 2.25,20.9 R2.2
  Bottom 0.254: 9.37,8.74 v9.35,8.44 9.37,8.44 | 9.37,8.8 9.37,8.74 | v3.09,19.76 3.49,19.84 3.71,19.92 4.85,18.78 11.73,18.78 15.41,15.1 15.41,15.08 15.79,14.7 15.79,14.18 15.09,13.48 13.59,13.48 9.39,9.24 9.37,8.74
N$3
  Top 0.305: R1.2 C6.1
N$4
  Top 1.016: C16.1 L2.2 U$1.SIG
N$5
  Top 0.254: U$9.P$3 40.75,16.96 39.99,16.22 38.82,16.22 TEENSY.24
N$6
  Top 0.254: U$9.P$1 39.15,19.04 38.23,18.12 38.23,18.02 38.19,17.98 38.19,17.04 TEENSY.25
N$7  (via drill 0.5)
  Top 0.254: U3.5 30.89,21.79 v30.93,21.82 | v17.73,14.32 19.61,16.2 v19.61,18.58
  Bottom 0.254: v30.93,21.82 30.77,21.82 30.69,21.74 30.69,20.02 28.83,18.16 20.03,18.16 v19.61,18.58 | U$3.MINUS 13.3,10.29 13.19,10.4 13.19,12.26 13.71,12.78 16.19,12.78 v17.73,14.32
N$8
  Top 0.813: 20.25,23.32 20.25,24.18 L2.1
  Top 1.016: L2.1 L3.1
  Top 1.303: RFM69.9 18.8,21.78 20.27,23.24 20.27,23.3 20.25,23.32
N$9
  Top 0.305: 3X3MM1.10 41.4,10.7 U$4.P$2
N$10  (via drill 0.5)
  Top 0.254: U3.8 30.89,17.59 v30.87,17.56 | 17.89,17.42 17.87,17.44 v17.85,17.44 14.95,14.54 v14.77,14.48
  Bottom 0.254: v30.87,17.56 17.97,17.56 v17.85,17.44 | 14.95,14.22 14.81,14.14 v14.77,14.48 12.89,16.36 6.27,16.36 3.2,13.29 U$3.PLUS
N$11
  Top 0.254: U3.3 34.43,19.99 35.09,20.64 35.09,20.99 R4.2
N$12
  Top 0.305: U3.4 33.84,22.04 34.43,22.62 35.3,22.62 R7.2
N$14
  Top 0.305: U$8.P$2 5.25,15.59 R5.1
N$15
  Top 0.305: U$8.P$3 4.89,14.94 5.23,14.6 5.23,13.46 5.43,13.26 6.15,13.26 R6.1
N$16
  Top 0.254: R7.1 37.02,23.32 C19.1
N$21
  Top 0.254: 6.84,9.73 IC1.5 5.26,8.98 R3.2
N$25
  Top 0.254: LED1.C 6.61,18.23 5.49,19.14 R2.1
N$31
  Top 0.254: 20.8,5.76 21.28,5.73 L1.2
  Top 0.61: U$5.5 21.25,5.76 21.28,5.73
PA_IN
  Top 0.305: C20.1 38.65,22.42 37.71,21.48 37.28,21.48 R4.1
  Top 0.406: R9.1 37.42,20.86 R4.1
PA_SHDN
  Top 0.254: U3.1 33.84,18.14 33.29,17.44 32.37,17.44 32.01,17.04 32.01,16.56 32.37,16.2 TEENSY.34
REG_EN  (via drill 0.5)
  Top 0.254: U$5.3 17.44,3.86 v17.85,4.2
  Bottom 0.254: v17.85,4.2 18.59,4.18 S1.1
  Bottom 0.305: R8.2 19.78,5.25 19.15,4.62 19.15,3.76 S1.1
RESET  (via drill 0.5, 0.6)
  Top 0.254: 3X3MM1.4 40.82,15.46 v39.51,15.02
  Top 0.305: 3X3MM1.13 43.13,10.36 43.37,10.12 43.55,9.56 42.31,8.32 42.09,8.44 v39.69,10.84 | v36.93,17.92 36.89,17.92 36.37,17.4 36.37,15.74 TEENSY.26
  Bottom 0.305: 36.79,13.02 36.83,12.98 | 36.83,12.98 36.83,13.06 38.51,14.44 39.55,14.7 v39.51,15.02 | v39.69,10.84 38.97,10.84 36.83,12.98 | v36.93,17.92 36.79,17.78 36.79,16.4 36.55,16.04 36.55,13.32 36.83,12.98
RFM_INT  (via drill 0.5 pad 0.25)
  Top 0.254: TEENSY.41 30.14,13 29.11,11.98 29.07,10.8 28.48,10.21 28.48,9.12 28.19,8.83 24.56,8.83 v20.51,11.77 | v14.05,11.73 11.55,11.73 RFM69.14
  Bottom 0.254: v20.51,11.77 14.08,11.77 v14.05,11.73
RFM_RESET
  Top 0.254: TEENSY.36 29.88,15.72 28.42,17.18 28.36,17.18 27.73,17.81 26.54,17.81 RFM69.6
SCL  (via drill 0.5 pad 0.25, 0.6 pad 0.25)
  Top 0.254: v35.42,17.06 35.42,16.92 34.9,16.39 34.9,15.73 TEENSY.29 | LIS3DH.4 6.6,22.65 v6.87,22.37
  Bottom 0.254: 35.45,16.89 v35.42,17.06 35.51,16.9 35.51,16.02 34.21,14.72 30.55,14.72 29.75,15.86 29.73,15.88 16.05,15.88 9.55,22.37 v6.87,22.37
SDA  (via drill 0.5 pad 0.25, 0.6 pad 0.25)
  Top 0.254: v34.18,17.24 34.34,16.92 34.37,16.89 TEENSY.30 | LIS3DH.6 5.2,22.69 v4.52,22.71
  Bottom 0.254: v34.18,17.24 34.37,16.88 TEENSY.30 34.09,15.44 30.79,15.44 29.85,16.38 16.27,16.38 9.63,23.02 7.47,23.02 7.21,23.2 6.25,23.2 LIS3DH.6 5.06,22.69 v4.52,22.71
SPI_CS
  Top 0.254: TEENSY.37 29.18,14.98 28.4,15.76 26.52,15.76 RFM69.5
SPI_MISO
  Top 0.254: TEENSY.40 29.95,13.49 28.62,12.15 28.62,11.03 27.35,9.76 26.52,9.76 RFM69.2
SPI_MOSI
  Top 0.254: TEENSY.39 29.76,13.99 27.56,11.8 26.52,11.8 RFM69.3
SPI_SCLK
  Top 0.254: TEENSY.38 29.26,14.5 28.57,13.81 26.54,13.81 RFM69.4
SWC
  Top 0.305: 3X3MM1.8 39.15,12.23 38.7,11.48 TEENSY.17
SWD
  Top 0.305: 3X3MM1.7 39.12,12.74 39.11,12.72 39.09,12.74 38.51,12.74 38.24,13 TEENSY.20
TAP  (via drill 0.5 pad 0.25, 0.6 pad 0.25)
  Top 0.254: v29.4,9.97 29.37,9.97 29.71,10.45 29.71,11.2 29.96,11.48 30.6,11.48 TEENSY.44 TEENSY.43 | LIS3DH.11 7.1,19.59 v7.09,19.58
  Bottom 0.254: v7.09,19.58 11.62,19.58 15.77,15.44 23.9,15.44 v29.4,9.97
USB_M  (via drill 0.5 pad 0.25)
  Top 0.305: R5.2 8.71,14.58 v8.73,14.56 | v32.91,5.78 TEENSY.4
  Bottom 0.305: v8.73,14.56 8.73,14.4 7.77,13.44 7.77,8.24 9.33,6.78 30.95,6.76 v32.91,5.78
USB_P  (via drill 0.5 pad 0.25)
  Top 0.305: R6.2 8.63,13.39 v8.71,13.12 | TEENSY.3 32.39,7.5 v32.07,7.08
  Bottom 0.305: v8.71,13.12 8.47,8.24 9.53,7.26 31.53,7.26 v32.07,7.08
V_BATT  (via drill 0.5)
  Top 0.254: 16.55,6.28 16.55,5.76 U$5.1
  Top 0.305: 29.37,19.85 C17.1 | C17.1 29.23,20.68 v29.21,20.76 C14.1 | U3.6 C17.1 | 14.34,2.44 C1.1
  Top 0.61: IC1.3 8.74,5.29 C8.1 | 16.03,6.02 16.29,6.02 U$5.1
  Top 0.813: C8.1 9.58,5.28 10.91,6.6 12.69,6.6 J2.2 14.49,4.79 C1.1
  Top 1.016: 29.23,21.41 C14.1 | 29.23,20.76 v29.21,20.76 | v21.35,20.52 21.35,15.94 21.37,15.92 21.37,15.58 18.51,12.72 18.51,9.08 16.55,7.12 16.55,6.28 | J2.2 14.21,5.2 14.95,5.94 15.95,5.94 16.03,6.02
  Bottom 0.305: S1.2 20.69,2.71 21.07,2.34 21.07,1.56 20.61,1.1 20.59,1.1 20.47,0.96 19.45,0.96 18.93,1.54 18.93,2.14 15.65,2.14 14.21,3.58 J2.2
  Bottom 1.016: v29.21,20.76 21.55,20.72 v21.35,20.52
V_USB
  Top 0.254: 6.87,16.54 6.81,16.48 C3.1 | 6.8,16.54 C3.1 | U$8.P$1 5.55,16.24 5.85,16.54 6.79,16.54 C3.1 | LED1.A 8.51,18.2 C3.1
  Top 0.305: 6.81,16.48 6.81,16.46 7.69,15.58 9.03,15.58 9.53,15.08 9.53,12.14 C9.1
  Top 0.61: IC1.4 8.74,11.18 C9.1
(copper drawn outside any net)
  shapes: Top area x4

### Text on the board
tNames: MIC | - | + | 3.3V
bNames: Speaker | GND | VBATT